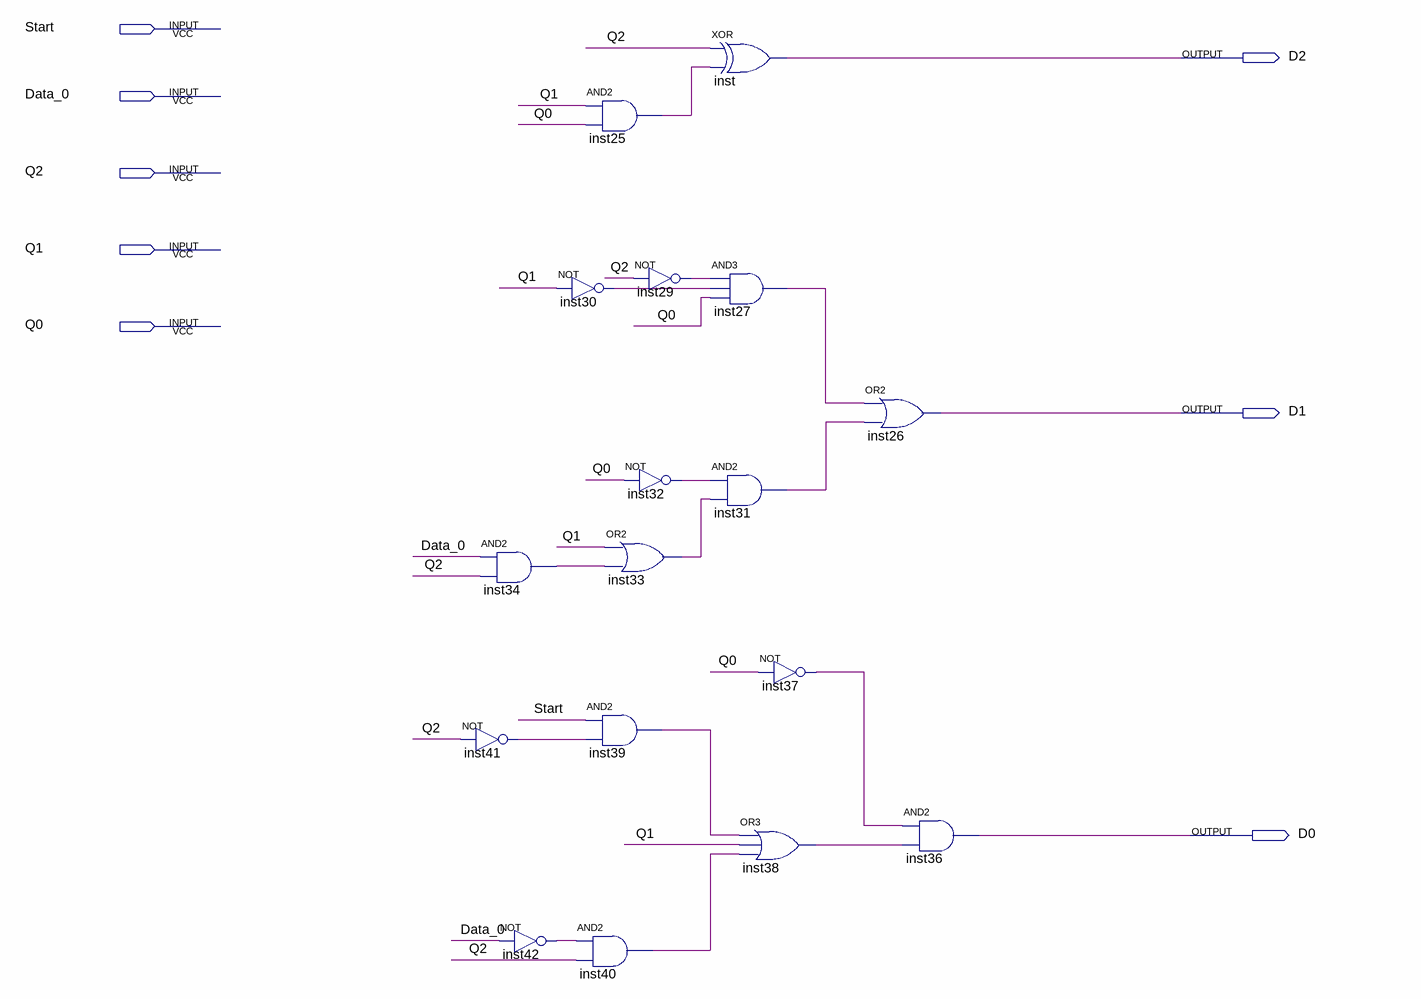
[diagram p0: schematic sheet]
// Quartus schematic Next_State.bdf as structural Verilog: 17 symbols, 8 pins
module Next_State (
  input  Start,
  input  Data_0,
  input  Q2,
  input  Q1,
  input  Q0,
  output D2,
  output D1,
  output D0
);

  wire inst25_out, inst27_out, inst29_out, inst30_out, inst31_out, inst32_out, inst33_out, inst34_out,
       inst37_out, inst38_out, inst39_out, inst40_out, inst41_out, inst42_out;

  and inst34 (inst34_out, Data_0, Q2);
  not inst41 (inst41_out, Q2);
  not inst42 (inst42_out, Data_0);
  and inst25 (inst25_out, Q1, Q0);
  not inst30 (inst30_out, Q1);
  or inst33 (inst33_out, Q1, inst34_out);
  and inst39 (inst39_out, Start, inst41_out);
  and inst40 (inst40_out, inst42_out, Q2);
  not inst29 (inst29_out, Q2);
  not inst32 (inst32_out, Q0);
  xor inst (D2, Q2, inst25_out);
  and inst27 (inst27_out, inst29_out, inst30_out, Q0);
  and inst31 (inst31_out, inst32_out, inst33_out);
  not inst37 (inst37_out, Q0);
  or inst38 (inst38_out, inst39_out, Q1, inst40_out);
  or inst26 (D1, inst27_out, inst31_out);
  and inst36 (D0, inst37_out, inst38_out);
endmodule
